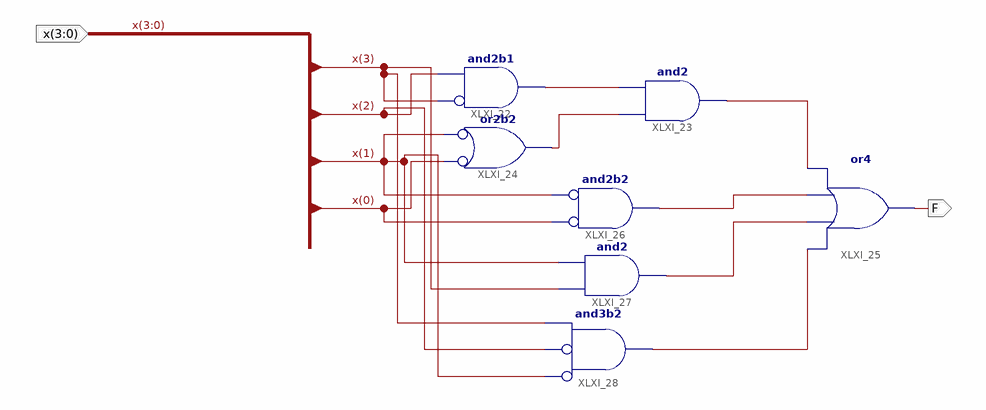
[diagram p0: schematic sheet 1]
// Xilinx ISE schematic scheme.sch (spartan6) as structural Verilog: 7 symbols, 2 ports
module scheme (
  input  [3:0] x,
  output F
);

  wire XLXN_45, XLXN_46, XLXN_49, XLXN_52, XLXN_53, XLXN_54;

  and XLXI_22 (XLXN_45, ~x[3], x[2]);  // and2b1
  and XLXI_23 (XLXN_49, XLXN_46, XLXN_45);
  or XLXI_24 (XLXN_46, ~x[0], ~x[1]);  // or2b2
  or XLXI_25 (F, XLXN_54, XLXN_53, XLXN_52, XLXN_49);
  and XLXI_26 (XLXN_52, ~x[0], ~x[1]);  // and2b2
  and XLXI_27 (XLXN_53, x[3], x[1]);
  and XLXI_28 (XLXN_54, ~x[1], ~x[2], x[3]);  // and3b2
endmodule
